# Altium schematic sheet Sheet8.SchDoc
size A4; SheetNumber: 8; SheetTotal: 8; SPICEModelCacheALVLEEKO: <root> / <DocumentId>ALVLEEKO</DocumentId> / <CacheFrame Number="0"> / <Model Name="and2_basic_gen" Kind="CKT"> / <Text>*$ / .SUBCKT AND2_BASIC_GEN A B Y PARAMS: VDD=1 VSS=0 VTHRESH=0.5 / E_ABMGATE    YINT 0 VALUE {{IF(V(A) &gt; {VTHRESH}  &amp; / + V(B) &gt; {VTHRESH},{VDD},{VSS})}} / RINT YINT Y 1 / CINT Y 0 1n / .ENDS AND2_BASIC_GEN</Text> / </Model> / </CacheFrame> / </root>
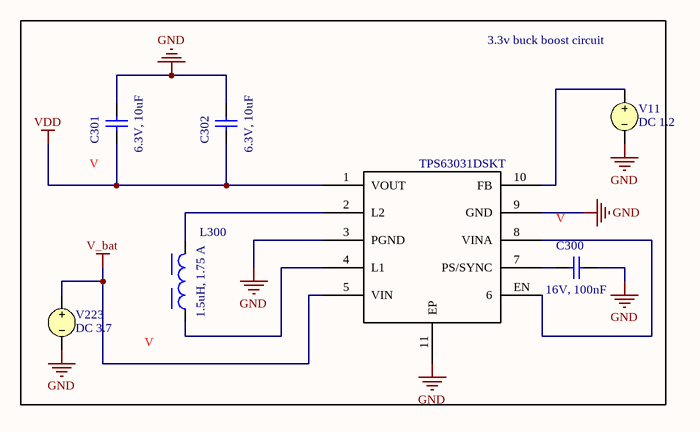
[diagram p0: Sheet8.SchDoc]

## Parts
C300  16V, 100nF  [WCAP-CSGP_0603_L1.6W0.8H0.8_Reflow]
C301  6.3V, 10uF  [WCAP-CSGP_0603_L1.6W0.8H0.8_Reflow]
C302  6.3V, 10uF  [WCAP-CSGP_0603_L1.6W0.8H0.8_Reflow]
L300  1.5uH, 1.75 A  [WE-TPC_3816]
U300  TPS63031DSKT  [TPS63031DSKT]
V11  DC 1.2
V223  DC 3.7

## Blocks framed on the sheet
3.3v buck boost circuit: C300-C302 L300 U300 V11 V223

## Nets
GND: C300.2 C301.2 C302.2 U300.3(PGND) U300.9(GND) U300.11(EP) V11.2 V223.2
V_bat: U300.5(VIN) V223.1
VDD: C301.1 C302.1 U300.1(VOUT)
NetC300_1: C300.1 U300.7(PS/SYNC)
NetL300_1: L300.1 U300.4(L1)
NetL300_2: L300.2 U300.2(L2)
NetU300_8: U300.8(VINA) U300.EN(6)
NetU300_10: U300.10(FB) V11.1

## Library data of the parts
C300 = CMP-03913-53914755-2: Cap Ceramic 0.1uF 16V X7R 10% Pad SMD 0603 125C T/R; Insulation Resistance: 5GΩ; Case/Package: 0603; Mount: Surface Mount; Voltage Rating (DC): 16V; Thickness: 863.6µm; RoHS: Compliant; Case Code (Metric): 1608; Tolerance: 10%; Capacitance: 100nF; Length: 1.6mm; Case Code (Imperial): 0603; Height: 800µm; Min Operating Temperature: -55°C; Voltage Rating: 16V; Width: 800µm; Max Operating Temperature: 125°C; REACH SVHC: Unknown; Dielectric: X7R; Value: 100nF
C301 C302 = CMP-03913-53914711-2: Ceramic Capacitor, Multilayer, Ceramic, 6.3V, 20% +Tol, 20% -Tol, X5R, 15% TC, 10uF, Surface Mount, 0603; Capacitance: 10µF; Insulation Resistance: 5MΩ; Value: 10µF; Min Operating Temperature: -55°C; Max Operating Temperature: 85°C; Length: 1.6mm; Mount: Surface Mount; Height: 800µm; Width: 800µm; Case Code (Metric): 1608; RoHS: Compliant; Thickness: 990.6µm; Voltage Rating (DC): 6.3V; Voltage Rating: 6.3V; Case/Package: 0603; REACH SVHC: Unknown; Tolerance: 20%; Case Code (Imperial): 0603; Dielectric: X5R
L300 = CMP-0227-00364-5: 100KHz 125MHz 1.55A 1.75A 1.5μH 47mΩ ±30% standard mounting，SMD mount 3.8mm*3.8mm*1.8mm; Manufacturer Lifecycle Status: ACTIVE; Core Material: Ferrite; DC Resistance (DCR): 40mΩ; Shielding: Shielded; Current Rating: 1.75A; Max Operating Temperature: 125°C; Self Resonant Frequency: 125MHz; Lifecycle Status: Production; Min Operating Temperature: -40°C; RMS Current (Irms): 1.75A; Weight: 102.993818mg; Height: 1.65mm; Length: 3.8mm; Height - Seated (Max): 1.8034mm; Ambient Temperature Range High: 85°C; Case/Package: Nonstandard; Inductance: 1.5µH; Resistance: 40mΩ; Series Resistance: 47mΩ; Saturation Current: 1.55A; RoHS: Compliant; REACH SVHC: Unknown; Termination: SMD/SMT; Max DC Current: 1.75A; Width: 3.8mm; Composition: Wirewound; Mount: Surface Mount; Inductance Tolerance: 30%; Tolerance: 30%; Test Frequency: 100kHz; Ambient Temperature Range Low: -40°C; Number of Pins: 2; Value: 1.5µH
U300 = TPS63031DSKT: High Efficient Single Inductor Buck-Boost Converter with 1-A Switches 10-SON -40 to 125
V11 = VSRC: Voltage Source; Note: PCB Footprint - Not required; AC Magnitude: 1; AC Phase: 0; Value: 1.2; Published: 8-Jun-2000; LatestRevisionDate: 17-Jul-2002; LatestRevisionNote: Re-released for DXP Platform.; PackageReference: Not Applicable; Publisher: Altium Limited
V223 = VSRC: Voltage Source; Note: PCB Footprint - Not required; AC Magnitude: 1; AC Phase: 0; Value: 3.7; Published: 8-Jun-2000; LatestRevisionDate: 17-Jul-2002; LatestRevisionNote: Re-released for DXP Platform.; PackageReference: Not Applicable; Publisher: Altium Limited